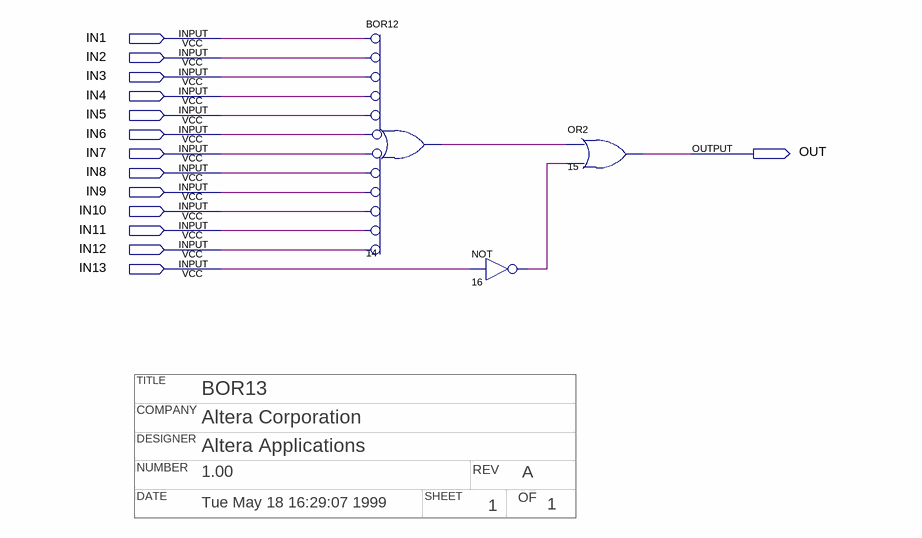
[diagram p0: schematic sheet]
// Quartus schematic bor13.bdf as structural Verilog: 3 symbols, 14 pins
// Title block: TITLE: BOR13; COMPANY: Altera Corporation; DESIGNER: Altera Applications; NUMBER: 1.00; REV: A; DATE: Tue May 18 16:29:07 1999; SHEET: 1; OF: 1
module bor13 (
  input  IN1,
  input  IN2,
  input  IN3,
  input  IN4,
  input  IN5,
  input  IN6,
  input  IN7,
  input  IN8,
  input  IN9,
  input  IN10,
  input  IN11,
  input  IN12,
  input  IN13,
  output OUT
);

  wire n14_out, n16_out;

  or u_14 (n14_out, ~IN1, ~IN2, ~IN3, ~IN4, ~IN5, ~IN6, ~IN7, ~IN8, ~IN9, ~IN10, ~IN11, ~IN12);  // BOR12
  not u_16 (n16_out, IN13);
  or u_15 (OUT, n14_out, n16_out);
endmodule
